# Altium schematic sheet host_board.SchDoc
size A3
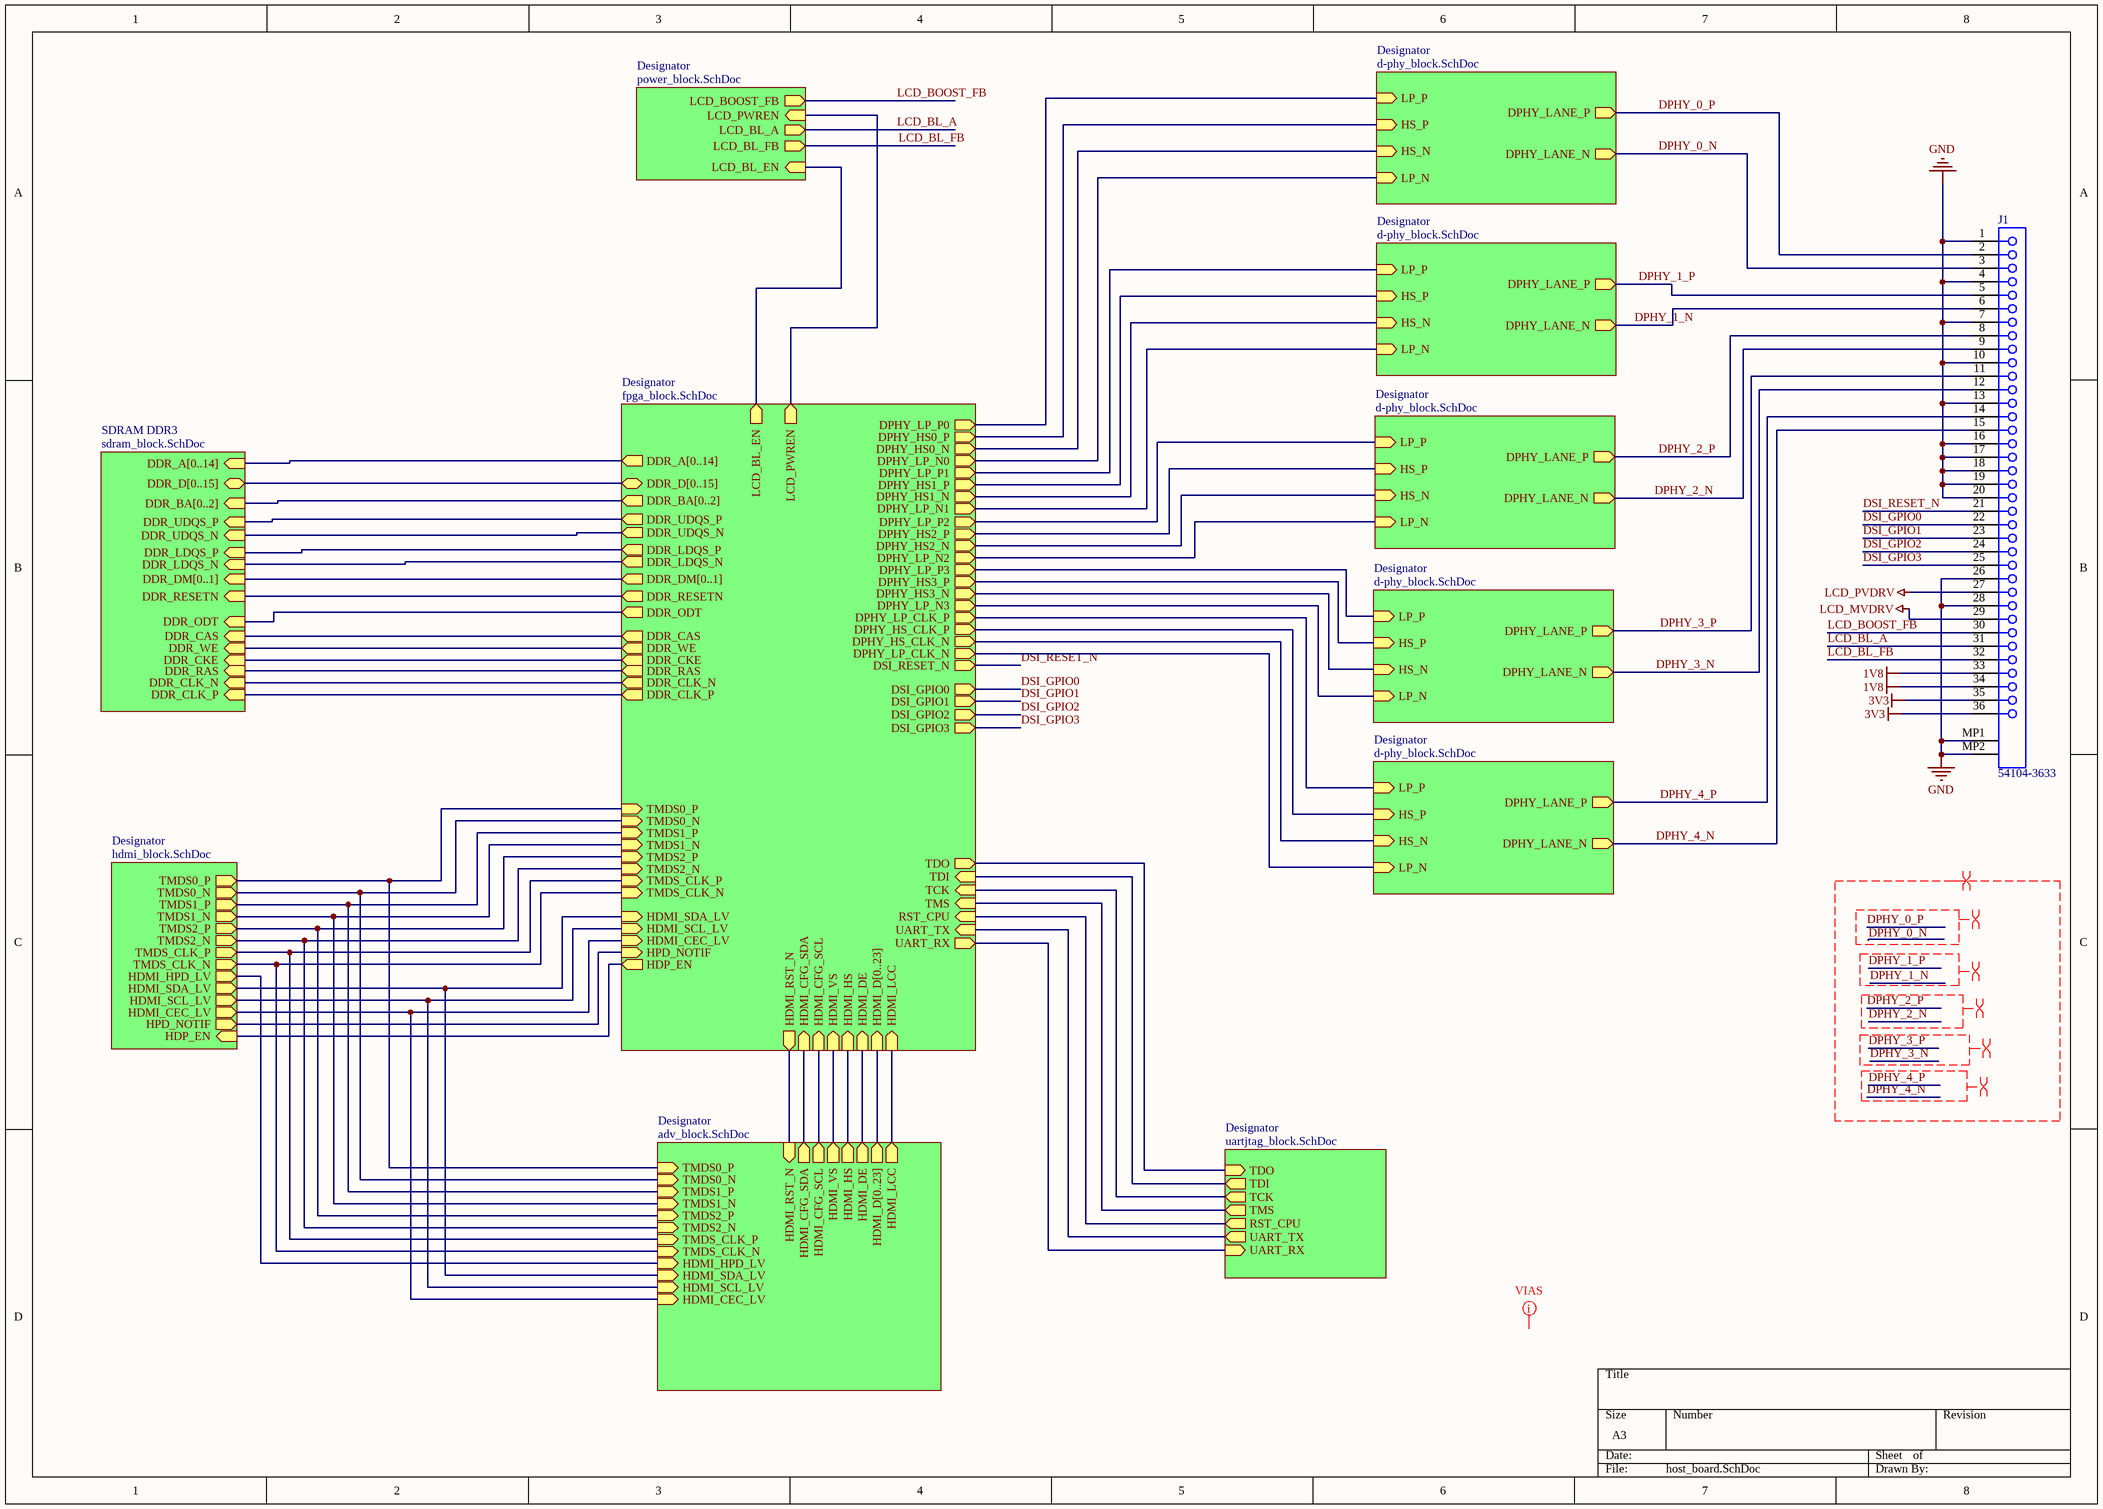
[diagram p0: host_board.SchDoc]

## Parts
J1  54104-3633  [MOLX-54104-3633]

## Sub-sheets
Designator = d-phy_block.SchDoc: LP_P (in), HS_P (in), HS_N (in), LP_N (in), DPHY_LANE_P (out), DPHY_LANE_N (out)
Designator = d-phy_block.SchDoc: LP_P (in), HS_P (in), HS_N (in), LP_N (in), DPHY_LANE_P (out), DPHY_LANE_N (out)
Designator = d-phy_block.SchDoc: LP_P (in), HS_P (in), HS_N (in), LP_N (in), DPHY_LANE_P (out), DPHY_LANE_N (out)
Designator = d-phy_block.SchDoc: LP_P (in), HS_P (in), HS_N (in), LP_N (in), DPHY_LANE_P (out), DPHY_LANE_N (out)
Designator = d-phy_block.SchDoc: LP_P (in), HS_P (in), HS_N (in), LP_N (in), DPHY_LANE_P (out), DPHY_LANE_N (out)
Designator = fpga_block.SchDoc: DDR_A[0..14] (out), DDR_D[0..15] (bidir), DDR_DM[0..1] (out), DDR_RESETN (out), DDR_ODT (out), DDR_CAS (out), DDR_WE (out), DDR_CKE (out), DDR_CLK_N (out), DDR_CLK_P (out), DDR_BA[0..2] (out), TMDS0_P (in), TMDS0_N (in), TMDS1_P (in), TMDS1_N (in), TMDS2_P (in), TMDS2_N (in), TMDS_CLK_P (in), TMDS_CLK_N (in), HDMI_SDA_LV (in), HDMI_SCL_LV (in), HDMI_CEC_LV (in), HPD_NOTIF (in), HDP_EN (out), HDMI_RST_N (out), HDMI_CFG_SDA (in), HDMI_CFG_SCL (in), HDMI_VS (in), HDMI_HS (in), HDMI_DE (in), HDMI_D[0..23] (in), HDMI_LCC (in), TDO (out), TDI (in), TCK (in), TMS (in), RST_CPU (in), UART_TX (in), UART_RX (out), LCD_PWREN (out), DPHY_LP_P0 (out), DPHY_HS0_P (out), DPHY_HS0_N (out), DPHY_LP_N0 (out), DPHY_LP_P1 (out), DPHY_HS1_P (out), DPHY_HS1_N (out), DPHY_LP_N1 (out), DPHY_LP_P2 (out), DPHY_HS2_P (out), DPHY_HS2_N (out), DPHY_LP_N2 (out), DPHY_LP_P3 (out), DPHY_HS3_P (out), DPHY_HS3_N (out), DPHY_LP_N3 (out), DPHY_LP_CLK_P (out), DPHY_HS_CLK_P (out), DPHY_HS_CLK_N (out), DPHY_LP_CLK_N (out), DSI_RESET_N (out), DSI_GPIO0 (out), DSI_GPIO1 (out), DSI_GPIO2 (out), DSI_GPIO3 (out), DDR_RAS (out), DDR_UDQS_P (out), DDR_UDQS_N (out), DDR_LDQS_P (out), DDR_LDQS_N (out), LCD_BL_EN (out)
Designator = adv_block.SchDoc: TMDS0_P (in), TMDS0_N (in), TMDS1_P (in), TMDS1_N (in), TMDS2_P (in), TMDS2_N (in), TMDS_CLK_P (in), TMDS_CLK_N (in), HDMI_HPD_LV (in), HDMI_SDA_LV (in), HDMI_SCL_LV (in), HDMI_CEC_LV (in), HDMI_RST_N (in), HDMI_CFG_SDA (out), HDMI_CFG_SCL (out), HDMI_VS (out), HDMI_HS (out), HDMI_DE (out), HDMI_D[0..23] (out), HDMI_LCC (out)
Designator = power_block.SchDoc: LCD_BOOST_FB (out), LCD_PWREN (in), LCD_BL_A (out), LCD_BL_FB (out), LCD_BL_EN (in)
Designator = uartjtag_block.SchDoc: TDO (in), TDI (out), TCK (out), TMS (out), RST_CPU (out), UART_TX (out), UART_RX (in)
Designator = hdmi_block.SchDoc: TMDS0_P (out), TMDS0_N (out), TMDS1_P (out), TMDS1_N (out), TMDS2_P (out), TMDS2_N (out), TMDS_CLK_P (out), TMDS_CLK_N (out), HDMI_HPD_LV (out), HDMI_SDA_LV (out), HDMI_SCL_LV (out), HDMI_CEC_LV (out), HPD_NOTIF (out), HDP_EN (in)
SDRAM DDR3 = sdram_block.SchDoc: DDR_A[0..14] (in), DDR_D[0..15] (bidir), DDR_DM[0..1] (in), DDR_RESETN (in), DDR_ODT (in), DDR_CAS (in), DDR_WE (in), DDR_CKE (in), DDR_CLK_N (in), DDR_CLK_P (in), DDR_BA[0..2] (in), DDR_RAS (in), DDR_UDQS_P (in), DDR_UDQS_N (in), DDR_LDQS_P (in), DDR_LDQS_N (in)

## Nets
1V8: J1.33 J1.34
3V3: J1.35 J1.36
GND: J1.1 J1.4 J1.7 J1.10 J1.13 J1.16 J1.17 J1.18 J1.19 J1.20 J1.26 J1.28 J1.MP1 J1.MP2
LCD_MVDRV: J1.29
LCD_PVDRV: J1.27
DPHY_0_N: J1.3 ; sheet Designator/DPHY_LANE_N
DPHY_0_P: J1.2 ; sheet Designator/DPHY_LANE_P
DPHY_1_N: J1.6 ; sheet Designator/DPHY_LANE_N
DPHY_1_P: J1.5 ; sheet Designator/DPHY_LANE_P
DPHY_2_N: J1.9 ; sheet Designator/DPHY_LANE_N
DPHY_2_P: J1.8 ; sheet Designator/DPHY_LANE_P
DPHY_3_N: J1.12 ; sheet Designator/DPHY_LANE_N
DPHY_3_P: J1.11 ; sheet Designator/DPHY_LANE_P
DPHY_4_N: J1.15 ; sheet Designator/DPHY_LANE_N
DPHY_4_P: J1.14 ; sheet Designator/DPHY_LANE_P
DSI_GPIO0: J1.22 ; sheet Designator/DSI_GPIO0
DSI_GPIO1: J1.23 ; sheet Designator/DSI_GPIO1
DSI_GPIO2: J1.24 ; sheet Designator/DSI_GPIO2
DSI_GPIO3: J1.25 ; sheet Designator/DSI_GPIO3
DSI_RESET_N: J1.21 ; sheet Designator/DSI_RESET_N
LCD_BL_A: J1.31 ; sheet Designator/LCD_BL_A
LCD_BL_FB: J1.32 ; sheet Designator/LCD_BL_FB
LCD_BOOST_FB: J1.30 ; sheet Designator/LCD_BOOST_FB
(unnamed): sheet SDRAM DDR3/DDR_RESETN, sheet Designator/DDR_RESETN
(unnamed): sheet SDRAM DDR3/DDR_ODT, sheet Designator/DDR_ODT
(unnamed): sheet SDRAM DDR3/DDR_CAS, sheet Designator/DDR_CAS
(unnamed): sheet SDRAM DDR3/DDR_WE, sheet Designator/DDR_WE
(unnamed): sheet SDRAM DDR3/DDR_CKE, sheet Designator/DDR_CKE
(unnamed): sheet SDRAM DDR3/DDR_CLK_N, sheet Designator/DDR_CLK_N
(unnamed): sheet SDRAM DDR3/DDR_CLK_P, sheet Designator/DDR_CLK_P
(unnamed): sheet SDRAM DDR3/DDR_RAS, sheet Designator/DDR_RAS
(unnamed): sheet SDRAM DDR3/DDR_UDQS_P, sheet Designator/DDR_UDQS_P
(unnamed): sheet SDRAM DDR3/DDR_UDQS_N, sheet Designator/DDR_UDQS_N
(unnamed): sheet SDRAM DDR3/DDR_LDQS_P, sheet Designator/DDR_LDQS_P
(unnamed): sheet SDRAM DDR3/DDR_LDQS_N, sheet Designator/DDR_LDQS_N
(unnamed): sheet Designator/LP_P, sheet Designator/DPHY_LP_P0
(unnamed): sheet Designator/HS_P, sheet Designator/DPHY_HS0_P
(unnamed): sheet Designator/HS_N, sheet Designator/DPHY_HS0_N
(unnamed): sheet Designator/LP_N, sheet Designator/DPHY_LP_N0
(unnamed): sheet Designator/LP_P, sheet Designator/DPHY_LP_P1
(unnamed): sheet Designator/HS_P, sheet Designator/DPHY_HS1_P
(unnamed): sheet Designator/HS_N, sheet Designator/DPHY_HS1_N
(unnamed): sheet Designator/LP_N, sheet Designator/DPHY_LP_N1
(unnamed): sheet Designator/LP_P, sheet Designator/DPHY_LP_P2
(unnamed): sheet Designator/HS_P, sheet Designator/DPHY_HS2_P
(unnamed): sheet Designator/HS_N, sheet Designator/DPHY_HS2_N
(unnamed): sheet Designator/LP_N, sheet Designator/DPHY_LP_N2
(unnamed): sheet Designator/LP_P, sheet Designator/DPHY_LP_P3
(unnamed): sheet Designator/HS_P, sheet Designator/DPHY_HS3_P
(unnamed): sheet Designator/HS_N, sheet Designator/DPHY_HS3_N
(unnamed): sheet Designator/LP_N, sheet Designator/DPHY_LP_N3
(unnamed): sheet Designator/LP_P, sheet Designator/DPHY_LP_CLK_P
(unnamed): sheet Designator/HS_P, sheet Designator/DPHY_HS_CLK_P
(unnamed): sheet Designator/HS_N, sheet Designator/DPHY_HS_CLK_N
(unnamed): sheet Designator/LP_N, sheet Designator/DPHY_LP_CLK_N
(unnamed): sheet Designator/TMDS0_P, sheet Designator/TMDS0_P, sheet Designator/TMDS0_P
(unnamed): sheet Designator/TMDS0_N, sheet Designator/TMDS0_N, sheet Designator/TMDS0_N
(unnamed): sheet Designator/TMDS1_P, sheet Designator/TMDS1_P, sheet Designator/TMDS1_P
(unnamed): sheet Designator/TMDS1_N, sheet Designator/TMDS1_N, sheet Designator/TMDS1_N
(unnamed): sheet Designator/TMDS2_P, sheet Designator/TMDS2_P, sheet Designator/TMDS2_P
(unnamed): sheet Designator/TMDS2_N, sheet Designator/TMDS2_N, sheet Designator/TMDS2_N
(unnamed): sheet Designator/TMDS_CLK_P, sheet Designator/TMDS_CLK_P, sheet Designator/TMDS_CLK_P
(unnamed): sheet Designator/TMDS_CLK_N, sheet Designator/TMDS_CLK_N, sheet Designator/TMDS_CLK_N
(unnamed): sheet Designator/HDMI_SDA_LV, sheet Designator/HDMI_SDA_LV, sheet Designator/HDMI_SDA_LV
(unnamed): sheet Designator/HDMI_SCL_LV, sheet Designator/HDMI_SCL_LV, sheet Designator/HDMI_SCL_LV
(unnamed): sheet Designator/HDMI_CEC_LV, sheet Designator/HDMI_CEC_LV, sheet Designator/HDMI_CEC_LV
(unnamed): sheet Designator/HPD_NOTIF, sheet Designator/HPD_NOTIF
(unnamed): sheet Designator/HDP_EN, sheet Designator/HDP_EN
(unnamed): sheet Designator/HDMI_RST_N, sheet Designator/HDMI_RST_N
(unnamed): sheet Designator/HDMI_CFG_SDA, sheet Designator/HDMI_CFG_SDA
(unnamed): sheet Designator/HDMI_CFG_SCL, sheet Designator/HDMI_CFG_SCL
(unnamed): sheet Designator/HDMI_VS, sheet Designator/HDMI_VS
(unnamed): sheet Designator/HDMI_HS, sheet Designator/HDMI_HS
(unnamed): sheet Designator/HDMI_DE, sheet Designator/HDMI_DE
(unnamed): sheet Designator/HDMI_LCC, sheet Designator/HDMI_LCC
(unnamed): sheet Designator/TDO, sheet Designator/TDO
(unnamed): sheet Designator/TDI, sheet Designator/TDI
(unnamed): sheet Designator/TCK, sheet Designator/TCK
(unnamed): sheet Designator/TMS, sheet Designator/TMS
(unnamed): sheet Designator/RST_CPU, sheet Designator/RST_CPU
(unnamed): sheet Designator/UART_TX, sheet Designator/UART_TX
(unnamed): sheet Designator/UART_RX, sheet Designator/UART_RX
(unnamed): sheet Designator/LCD_PWREN, sheet Designator/LCD_PWREN
(unnamed): sheet Designator/LCD_BL_EN, sheet Designator/LCD_BL_EN
(unnamed): sheet Designator/HDMI_HPD_LV, sheet Designator/HDMI_HPD_LV

## Buses and harness runs
bus sheet Designator/DDR_A[0..14] = sheet SDRAM DDR3/DDR_A[0..14]
bus sheet Designator/DDR_BA[0..2] = sheet SDRAM DDR3/DDR_BA[0..2]
bus sheet Designator/DDR_D[0..15] = sheet SDRAM DDR3/DDR_D[0..15]
bus sheet Designator/DDR_DM[0..1] = sheet SDRAM DDR3/DDR_DM[0..1]

## Layout directives
rule Routing Via Style [Pref Size = 0.4mm    Pref Hole Size = 0.2mm]; rule Clearance Constraint [Clearance = 0.1mm]: (no net found under the mark)
differential pair; rule Matched Net Lengths [Tolerance = 1mm]; rule Differential Pairs Routing [Pref Gap = 0.1mm    Min Gap  = 0.1mm    Max Gap  = 0.2mmPref Width = 0.1mm    Min Width  = 0.1mm    Max Width  = 0.2mm]; net class DPHY_OUT: DPHY_0_N, DPHY_0_P, DPHY_1_N, DPHY_1_P, DPHY_2_N, DPHY_2_P, DPHY_3_N, DPHY_3_P, DPHY_4_N, DPHY_4_P
rule Matched Net Lengths [Tolerance = 1mm]; net class DPHY_0: DPHY_0_N, DPHY_0_P
rule Matched Net Lengths [Tolerance = 1mm]; net class DPHY_1: DPHY_1_N, DPHY_1_P
rule Matched Net Lengths [Tolerance = 1mm]; net class DPHY_2: DPHY_2_N, DPHY_2_P
rule Matched Net Lengths [Tolerance = 1mm]; net class DPHY_3: DPHY_3_N, DPHY_3_P
rule Matched Net Lengths [Tolerance = 1mm]; net class DPHY_4: DPHY_4_N, DPHY_4_P

## Library data of the parts
J1 = 54104-3633: 0.5 mm Pitch Easy-On(TM) Type FPC Connector, 2.0 mm Mated Height, Right Angle, ZIF, SMT, Top Contact, 36 Circuits, -40 to 85 degC, ELV and RoHS Compliant, Tape and Reel; Manufacturer: Molex; Circuits (Loaded): 36; Current (Max per Contact): 0.5A; Durability (mating cycles max): 20; Entry Angle: 90degrees Angle; Mated Height: 2.00mm; Material - Metal: Phosphor Bronze; Material - Plating Mating: Silver, Tin-Bismuth; PCB Locator: No; PCB Retention: None; Pitch - Mating Interface: 0.50mm; Polarized to PCB: Yes; Voltage (Max): 50V; PackageVersion: Rev. C, 04/2014; PackageReference: 54104-3633; PackageDescription: 36-Lead FPC Connector, Pitch 0.5 mm; Supplier 1: Mouser; Supplier Part Number 1: 538-54104-3633; Contact Position: Top; Material - Plating Termination: Silver, Tin-Bismuth; Number of Rows: 1; Orientation: Right Angle; Packing: Tape and Reel; Pitch - Termination Interface: 0.50mm; RoHS: TRUE; Stackable: No; Mounting Technology: Surface Mount; PartNumber: 54104-3633; ComponentLink1Description: Manufacturer URL; ComponentLink1URL: http://www.molex.com/molex/index.jsp; ComponentLink2Description: Datasheet; ComponentLink2URL: http://www.molex.com/webdocs/datasheets/pdf/en-us/0541043633_FFC_FPC_CONNECTORS.pdf; ComponentLink3Description: Package Specification; ComponentLink3URL: http://www.molex.com/pdm_docs/sd/541043633_sd.pdf